# Altium schematic sheet 10-TEST_PORT.SchDoc
size C
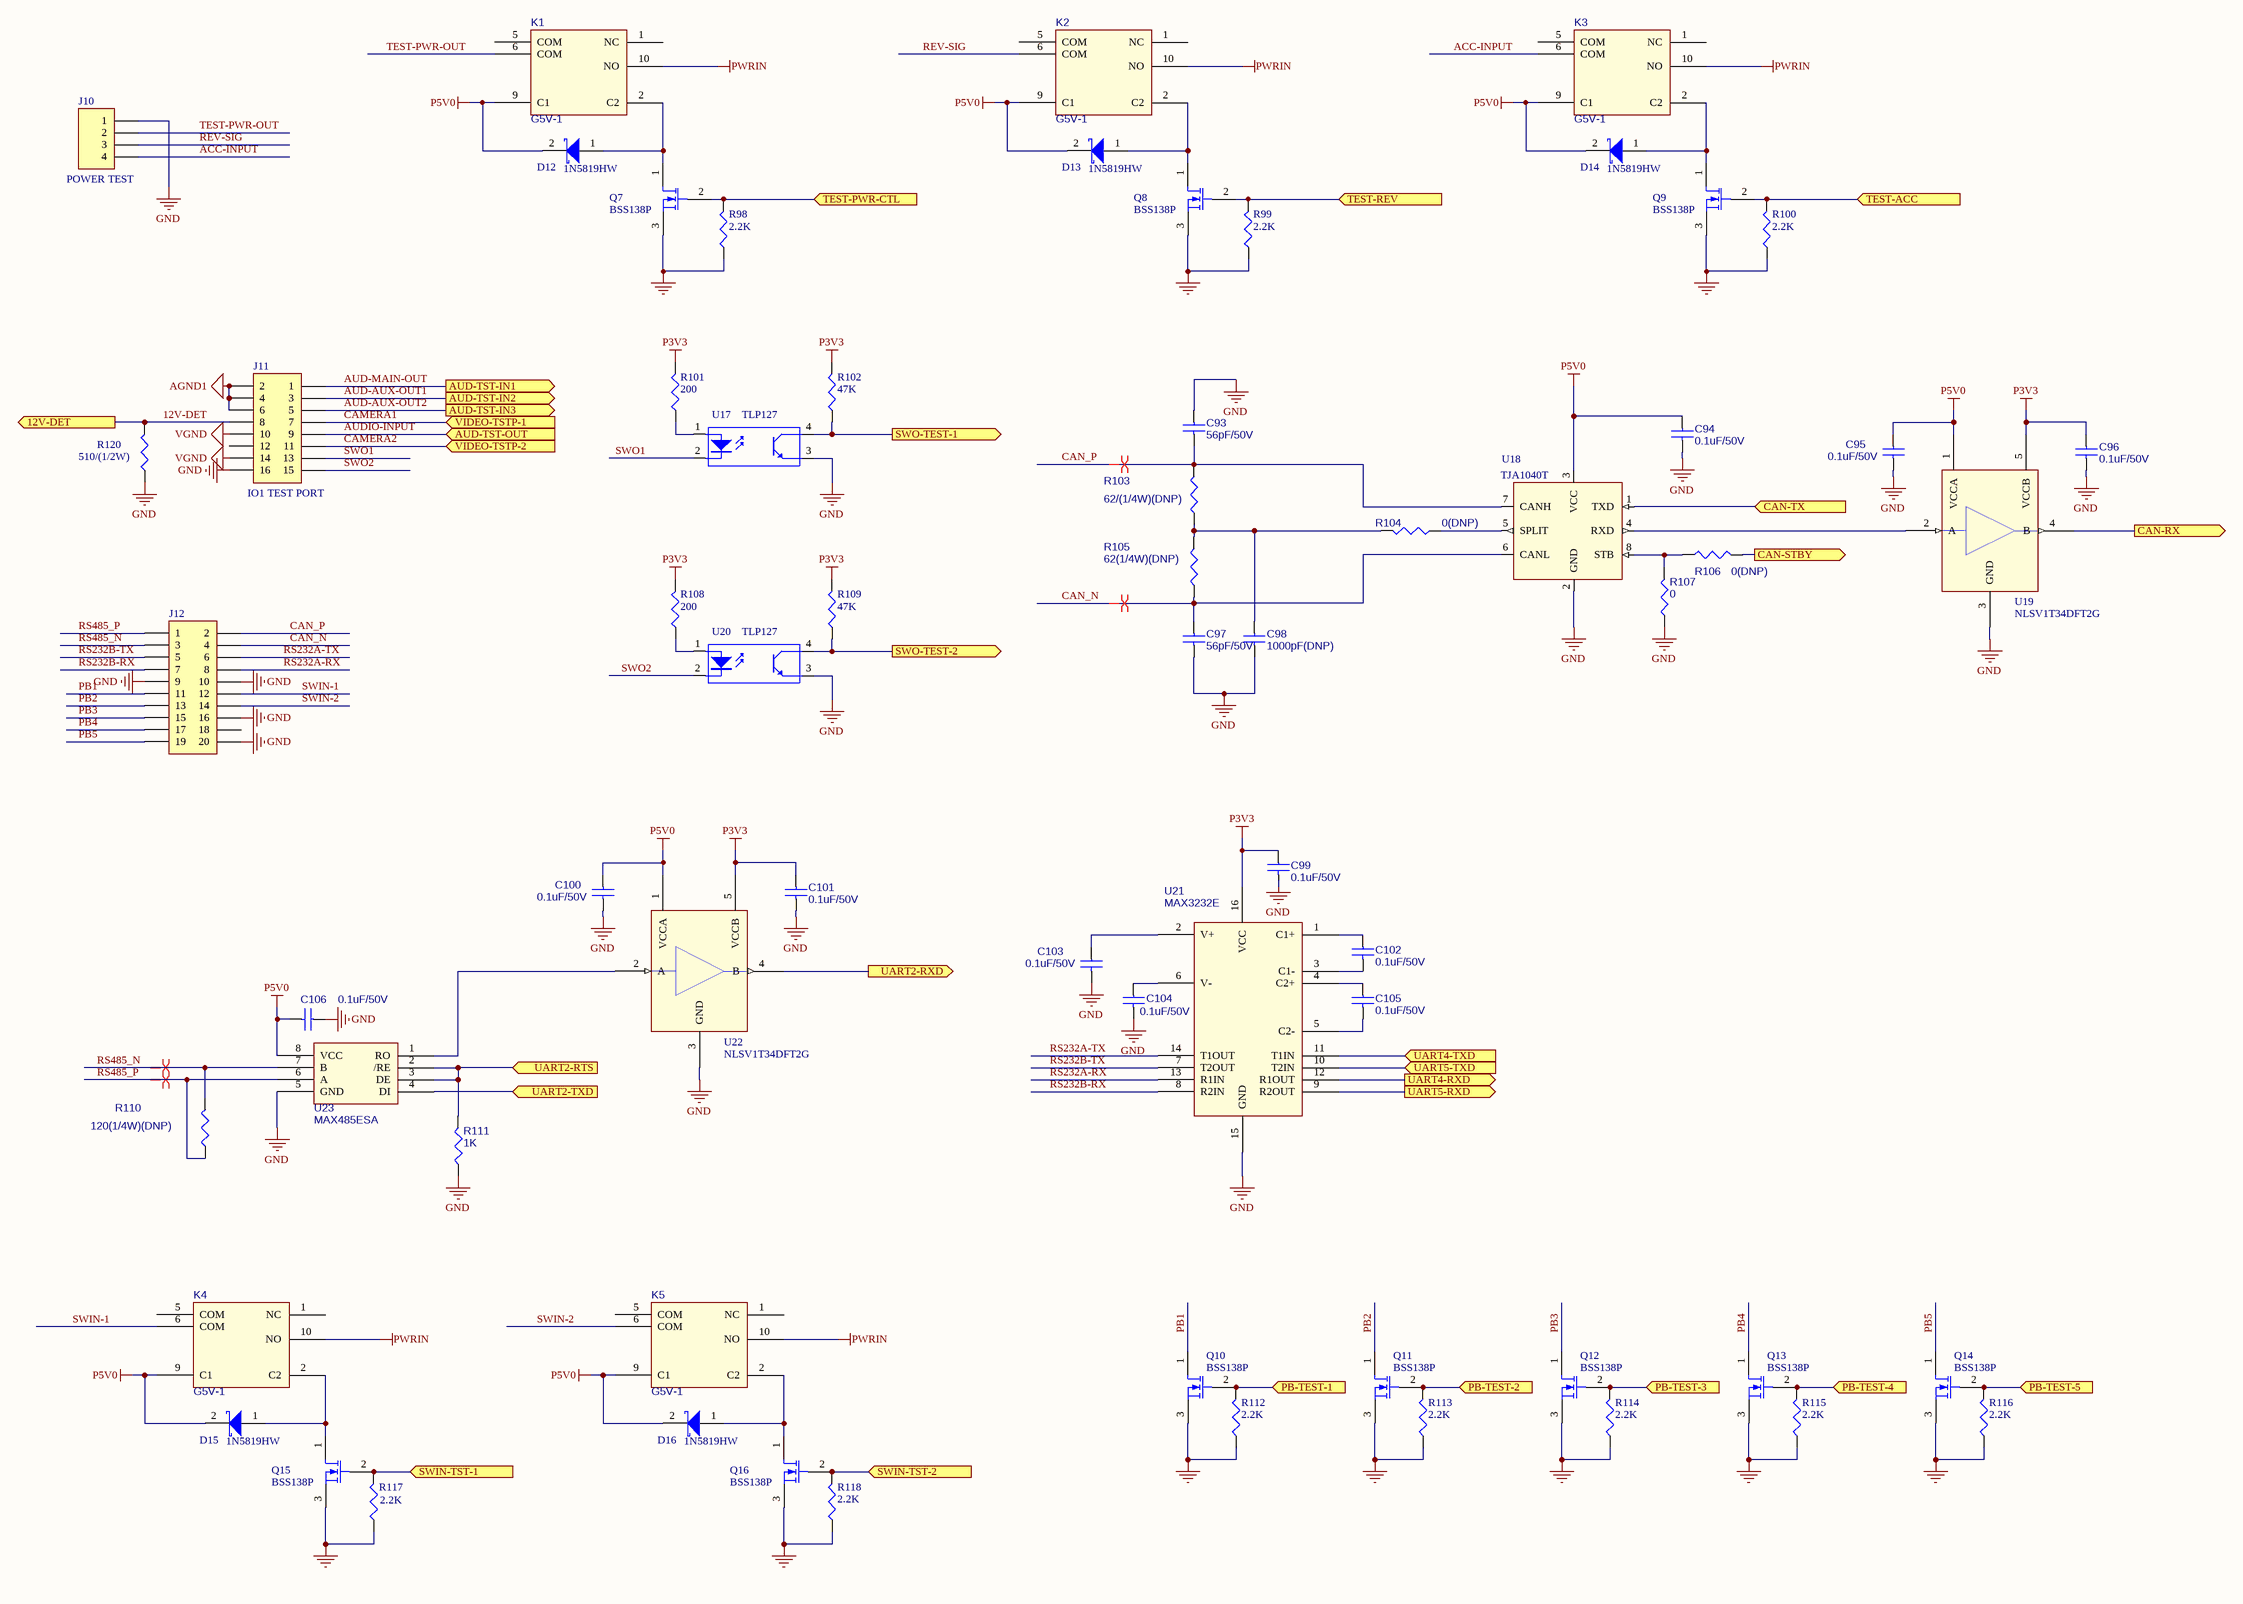
[diagram p0: 10-TEST_PORT.SchDoc]

## Parts
C93  56pF/50V  [0402]
C94  0.1uF/50V  [0402]
C95  0.1uF/50V  [0402]
C96  0.1uF/50V  [0402]
C97  56pF/50V  [0402]
C98  1000pF(DNP)  [0402]
C99  0.1uF/50V  [0402]
C100  0.1uF/50V  [0402]
C101  0.1uF/50V  [0402]
C102  0.1uF/50V  [0402]
C103  0.1uF/50V  [0402]
C104  0.1uF/50V  [0402]
C105  0.1uF/50V  [0402]
C106  0.1uF/50V  [0402]
D12  1N5819HW  [1N5819]
D13  1N5819HW  [1N5819]
D14  1N5819HW  [1N5819]
D15  1N5819HW  [1N5819]
D16  1N5819HW  [1N5819]
J10  POWER TEST  [3030WR-S-2*2P]
J11  IO1 TEST PORT  [3030WR-S-2*8P]
J12  Header 10X2  [3030WR-S-2*10P]  (value not drawn)
K1  G5V-1  [G5V-1]
K2  G5V-1  [G5V-1]
K3  G5V-1  [G5V-1]
K4  G5V-1  [G5V-1]
K5  G5V-1  [G5V-1]
Q7  BSS138P  [NPN]
Q8  BSS138P  [NPN]
Q9  BSS138P  [NPN]
Q10  BSS138P  [NPN]
Q11  BSS138P  [NPN]
Q12  BSS138P  [NPN]
Q13  BSS138P  [NPN]
Q14  BSS138P  [NPN]
Q15  BSS138P  [NPN]
Q16  BSS138P  [NPN]
R98  2.2K  [0402]
R99  2.2K  [0402]
R100  2.2K  [0402]
R101  200  [0402]
R102  47K  [0402]
R103  62/(1/4W)(DNP)  [1206]
R104  0(DNP)  [0402]
R105  62(1/4W)(DNP)  [1206]
R106  0(DNP)  [0402]
R107  0  [0402]
R108  200  [0402]
R109  47K  [0402]
R110  120(1/4W)(DNP)  [1206]
R111  1K  [0402]
R112  2.2K  [0402]
R113  2.2K  [0402]
R114  2.2K  [0402]
R115  2.2K  [0402]
R116  2.2K  [0402]
R117  2.2K  [0402]
R118  2.2K  [0402]
R120  510/(1/2W)  [1812]
U17  TLP127  [TLP127]
U18  TJA1040T  [SO8]
U19  NLSV1T34DFT2G  [SC70]
U20  TLP127  [TLP127]
U21  MAX3232E  [SO-16]
U22  NLSV1T34DFT2G  [SC70]
U23  MAX485ESA  [SO8]

## Ports
12V-DET (out), AUD-TST-IN1 (out), AUD-TST-IN2 (out), AUD-TST-IN3 (out), AUD-TST-OUT (in), CAN-RX (out), CAN-STBY (out), CAN-TX (in), PB-TEST-1 (in), PB-TEST-2 (in), PB-TEST-3 (in), PB-TEST-4 (in), PB-TEST-5 (in), SWIN-TST-1 (in), SWIN-TST-2 (in), SWO-TEST-1 (out), SWO-TEST-2 (out), TEST-ACC (in), TEST-PWR-CTL (in), TEST-REV (in), UART2-RTS (in), UART2-RXD (out), UART2-TXD (in), UART4-RXD (out), UART4-TXD (in), UART5-RXD (out), UART5-TXD (in), VIDEO-TSTP-1 (in), VIDEO-TSTP-2 (in)

## Nets
AGND1: J11.2 J11.4 J11.6
GND: C93.1 C94.2 C95.2 C96.2 C97.2 C98.2 C99.2 C100.2 C101.2 C103.2 C104.2 C106.1 J10.1 J11.16 J12.9 J12.10 J12.16 J12.20 Q7.3(S) Q8.3(S) Q9.3(S) Q10.3(S) Q11.3(S) Q12.3(S) Q13.3(S) Q14.3(S) Q15.3(S) Q16.3(S) R98.2 R99.2 R100.2 R107.2 R111.2 R112.2 R113.2 R114.2 R115.2 R116.2 R117.2 R118.2 R120.2 U17.3(E) U18.2(GND) U19.3(GND) U20.3(E) U21.15(GND) U22.3(GND) U23.5(GND)
P3V3: C96.1 C99.1 C101.1 R101.1 R102.1 R108.1 R109.1 U19.5(VCCB) U21.16(VCC) U22.5(VCCB)
P5V0: C94.1 C95.1 C100.1 C106.2 D12.2(K) D13.2(K) D14.2(K) D15.2(K) D16.2(K) K1.9(C1) K2.9(C1) K3.9(C1) K4.9(C1) K5.9(C1) U18.3(VCC) U19.1(VCCA) U22.1(VCCA) U23.8(VCC)
PWRIN: K1.10(NO) K2.10(NO) K3.10(NO) K4.10(NO) K5.10(NO)
VGND: J11.10 J11.14
12V-DET: J11.8 R120.1 ; port 12V-DET
ACC-INPUT: J10.4 K3.6(COM)
AUD-AUX-OUT1: J11.3 ; port AUD-TST-IN2
AUD-AUX-OUT2: J11.5 ; port AUD-TST-IN3
AUD-MAIN-OUT: J11.1 ; port AUD-TST-IN1
AUDIO-INPUT: J11.9 ; port AUD-TST-OUT
CAMERA1: J11.7 ; port VIDEO-TSTP-1
CAMERA2: J11.11 ; port VIDEO-TSTP-2
CAN-RX: U19.4(B) ; port CAN-RX
CAN-STBY: R106.1 ; port CAN-STBY
CAN-TX: U18.1(TXD) ; port CAN-TX
CAN_N: C97.1 J12.4 R105.2 U18.6(CANL)
CAN_P: C93.2 J12.2 R103.1 U18.7(CANH)
PB1: J12.11 Q10.1(D)
PB2: J12.13 Q11.1(D)
PB3: J12.15 Q12.1(D)
PB4: J12.17 Q13.1(D)
PB5: J12.19 Q14.1(D)
PB-TEST-1: Q10.2(G) R112.1 ; port PB-TEST-1
PB-TEST-2: Q11.2(G) R113.1 ; port PB-TEST-2
PB-TEST-3: Q12.2(G) R114.1 ; port PB-TEST-3
PB-TEST-4: Q13.2(G) R115.1 ; port PB-TEST-4
PB-TEST-5: Q14.2(G) R116.1 ; port PB-TEST-5
REV-SIG: J10.3 K2.6(COM)
RS232A-RX: J12.8 U21.13(R1IN)
RS232A-TX: J12.6 U21.14(T1OUT)
RS232B-RX: J12.7 U21.8(R2IN)
RS232B-TX: J12.5 U21.7(T2OUT)
RS485_N: J12.3 R110.1 U23.7(B)
RS485_P: J12.1 R110.2 U23.6(A)
SWIN-1: J12.12 K4.6(COM)
SWIN-2: J12.14 K5.6(COM)
SWIN-TST-1: Q15.2(G) R117.1 ; port SWIN-TST-1
SWIN-TST-2: Q16.2(G) R118.1 ; port SWIN-TST-2
SWO1: J11.13 U17.2(K)
SWO2: J11.15 U20.2(K)
SWO-TEST-1: R102.2 U17.4(C) ; port SWO-TEST-1
SWO-TEST-2: R109.2 U20.4(C) ; port SWO-TEST-2
TEST-ACC: Q9.2(G) R100.1 ; port TEST-ACC
TEST-PWR-CTL: Q7.2(G) R98.1 ; port TEST-PWR-CTL
TEST-PWR-OUT: J10.2 K1.6(COM)
TEST-REV: Q8.2(G) R99.1 ; port TEST-REV
UART2-RTS: R111.1 U23.2(/RE) U23.3(DE) ; port UART2-RTS
UART2-RXD: U22.4(B) ; port UART2-RXD
UART2-TXD: U23.4(DI) ; port UART2-TXD
UART4-RXD: U21.12(R1OUT) ; port UART4-RXD
UART4-TXD: U21.11(T1IN) ; port UART4-TXD
UART5-RXD: U21.9(R2OUT) ; port UART5-RXD
UART5-TXD: U21.10(T2IN) ; port UART5-TXD
NetC98_1: C98.1 R103.2 R104.1 R105.1
NetC102_1: C102.1 U21.1(C1+)
NetC102_2: C102.2 U21.3(C1-)
NetC103_1: C103.1 U21.2(V+)
NetC104_1: C104.1 U21.6(V-)
NetC105_1: C105.1 U21.4(C2+)
NetC105_2: C105.2 U21.5(C2-)
NetD12_1: D12.1(A) K1.2(C2) Q7.1(D)
NetD13_1: D13.1(A) K2.2(C2) Q8.1(D)
NetD14_1: D14.1(A) K3.2(C2) Q9.1(D)
NetD15_1: D15.1(A) K4.2(C2) Q15.1(D)
NetD16_1: D16.1(A) K5.2(C2) Q16.1(D)
NetR101_2: R101.2 U17.1(A)
NetR104_2: R104.2 U18.5(SPLIT)
NetR106_2: R106.2 R107.1 U18.8(STB)
NetR108_2: R108.2 U20.1(A)
NetU18_4: U18.4(RXD) U19.2(A)
NetU22_2: U22.2(A) U23.1(RO)

Not connected (* = marked no-connect by the designer): J11 12; J12 18; K1 1(NC) 5(COM); K2 1(NC) 5(COM); K3 1(NC) 5(COM); K4 1(NC) 5(COM); K5 1(NC) 5(COM)

## Layout directives
differential pair: CAN_N, CAN_P, RS485_N, RS485_P

## Library data of the parts
C93-C98 C100 C101 = P_CAP NP
C99 C102-C105 = CAP
C106 = P_CAP NP: Part Number: SE132225K8L; Part Description: S CER CAP 2.2U 10V K X5R 0603; Function Field: 41.5; Ecology: YES; ROOM: GPS; AP: AP; Part Type: CAPACITOR; Approved Date: 6/27/2006; Lead Free: MY
D12-D16 = Diode 11DQ03: Schottky Rectifier
J10 = Header 4: Header, 4-Pin; LatestRevisionDate: 17-Jul-2002; LatestRevisionNote: Re-released for DXP Platform.; Publisher: Altium Limited
J11 = Header 8X2: Header, 8-Pin, Dual row; LatestRevisionDate: 17-Jul-2002; LatestRevisionNote: Re-released for DXP Platform.; Publisher: Altium Limited
J12 = Header 10X2: Header, 10-Pin, Dual row; LatestRevisionDate: 17-Jul-2002; LatestRevisionNote: Re-released for DXP Platform.; Publisher: Altium Limited
K1-K5 = G5V-1_0
Q7-Q16 = MOSFET-N: N-Channel MOSFET; Published: 8-Jun-2000; LatestRevisionDate: 17-Jul-2002; LatestRevisionNote: Re-released for DXP Platform.; PackageVersion: 1995/1996; PackageReference: E3; Publisher: Altium Limited; PackageDescription: TO, Flat Index; 3 In-Line, Axial Leads; Body Dia. 4.6mm; Lead Dia. 0.5 mm (max)
R98-R102 R108 R109 R112-R118 R120 = Res3: Resistor; Value: 0.1/1W; Published: 8-Jun-2000; LatestRevisionDate: 29-May-2009; LatestRevisionNote: IPC-7351 Footprint Added.; PackageReference: J1-0603; Publisher: Altium Limited; PackageDescription: Chip Resistor
R103-R107 = P_R
R110 R111 = R: Manufacturer Part number: null; Part Description: S RES 1/16W 10K +-5% 0402; Part Number: SD02810028L; ROOM: SD; Deletion Flag: 0; Function Field: 32.3; Ecology: YES; Part Type: RESISTOR; AP Sheet: http://ISPDPRD/Windchill/servlet/WindchillAuthGW/wt.enterprise.URLProcessor/URLTemplateAction?u8&oid=VR%3Aext.compal.part.Comp; AP: AP; Lead Free: Y1
U17 U20 = Optoisolator1: 4-Pin Phototransistor Optocoupler; Published: 24-Mar-1999; LatestRevisionDate: 04-Mar-2005; LatestRevisionNote: Sch pins 3 & 4 Swapped.; DatasheetVersion: Nov-2003; PackageReference: DIP-4; Publisher: Altium Limited
U18 = TJA1040T_SO_8P: IC XCVR CAN HS 5V SO8; CAD_APPROVED: Yes; MFG_NAME01: NXP SEMICONDUCTORS; AGILE_PN: 312-79676; CLASS: IC; HEIGHT: 1.75 MM; ROHS: Yes; MFG_PN01: TJA1040T
U21 = MAX3232
U23 = MAX485